# EAGLE design singleAxisMotor3 (EAGLE 5.10)
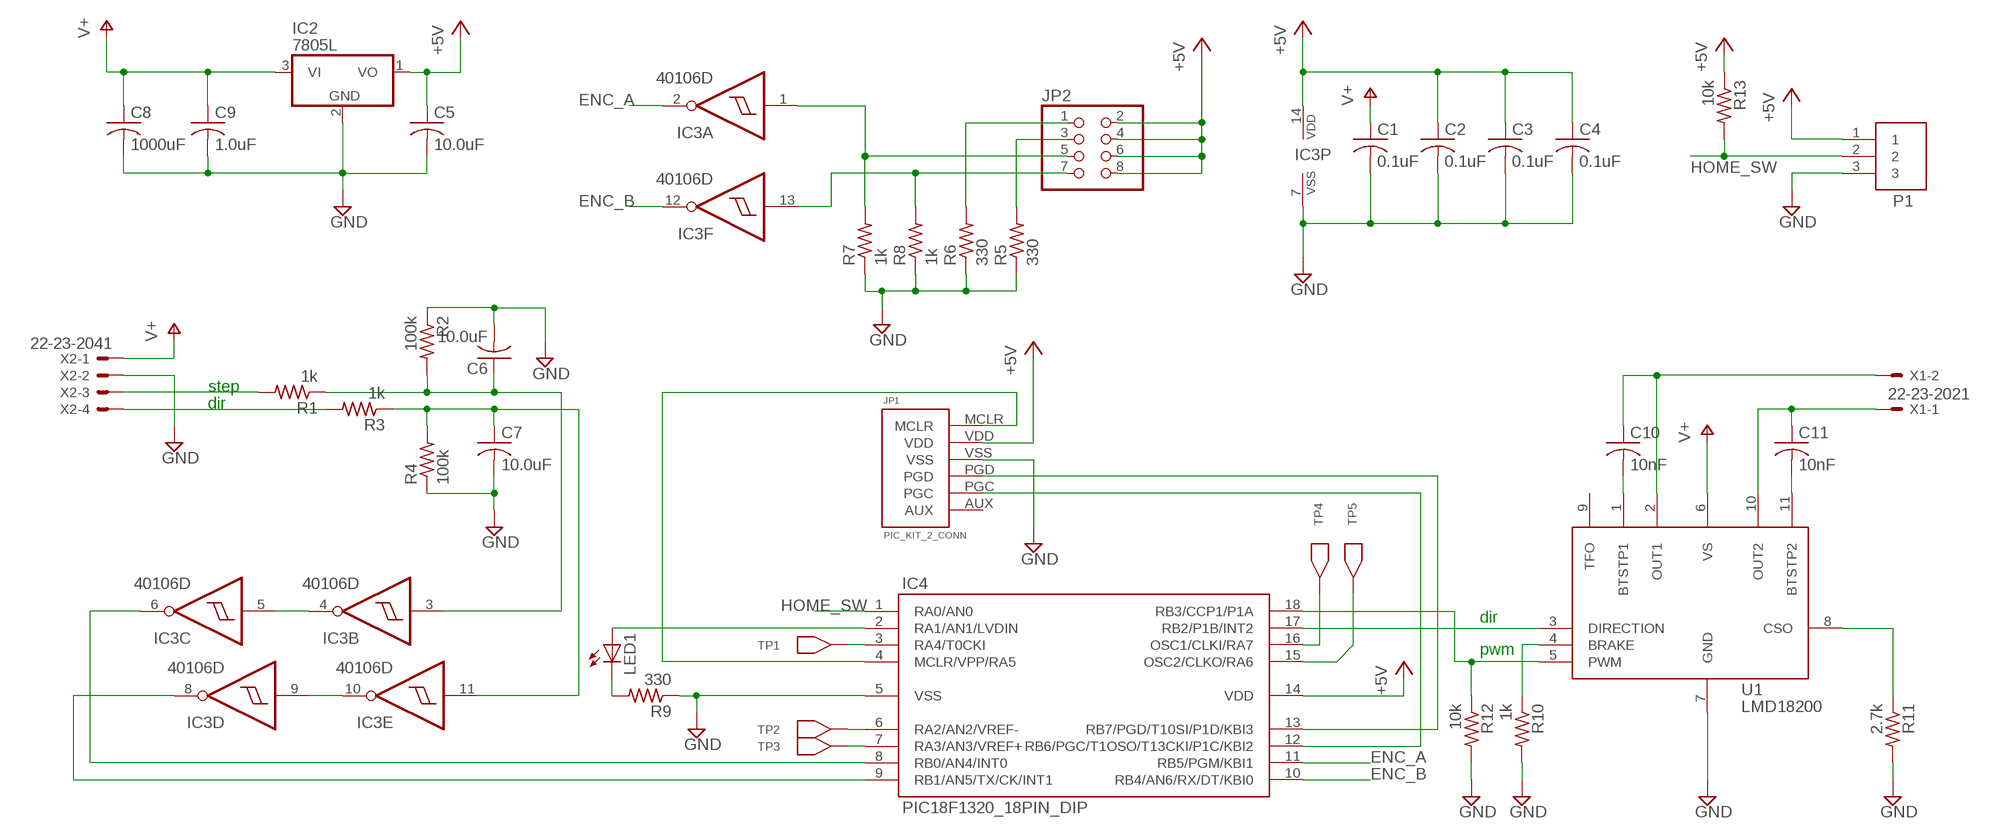
[diagram p0: schematic, sheet 1]

## Parts
C1  0.1uF  C-USC1206  [C1206]
C2  0.1uF  C-USC1206  [C1206]
C3  0.1uF  C-USC1206  [C1206]
C4  0.1uF  C-USC1206  [C1206]
C5  10.0uF  C-US025-024X044  [C025-024X044]
C6  10.0uF  C-USC1206  [C1206]
C7  10.0uF  C-USC1206  [C1206]
C8  1000uF  C-US025-024X044  [C025-024X044]
C9  1.0uF  C-USC1206  [C1206]
C10  10nF  C-USC1206  [C1206]
C11  10nF  C-USC1206  [C1206]
IC2  7805L  [TO92]
IC3  40106D  [SO14]
IC4  PIC18F1320_18PIN_DIP  [SO-18W]
JP1  PIC_KIT_2_CONN  [PIC_KIT_2_CONN]
JP2  PINHD-2X4  [2X04]
LED1  LEDCHIPLED_1206  [CHIPLED_1206]
P1  3PIN  [3PIN]
R1  1k  R-US_0207/2V  [0207/2V]
R2  100k  R-US_0207/2V  [0207/2V]
R3  1k  R-US_0207/2V  [0207/2V]
R4  100k  R-US_0207/2V  [0207/2V]
R5  330  R-US_0207/2V  [0207/2V]
R6  330  R-US_0207/2V  [0207/2V]
R7  1k  R-US_0207/2V  [0207/2V]
R8  1k  R-US_0207/2V  [0207/2V]
R9  330  R-US_0207/2V  [0207/2V]
R10  1k  R-US_M1206  [M1206]
R11  2.7k  R-US_M1206  [M1206]
R12  10k  R-US_M1206  [M1206]
R13  10k  R-US_M1206  [M1206]
TP1  1PAD  [1PAD]
TP2  1PAD  [1PAD]
TP3  1PAD  [1PAD]
TP4  1PAD  [1PAD]
TP5  1PAD  [1PAD]
U1  LMD18200  [TO-220-WIDE]
X1  22-23-2021  [22-23-2021]
X2  22-23-2041  [22-23-2041]

## Nets
+5V: C2.1 C3.1 C4.1 C5.1 IC2.1(VO) IC3.14(P:VDD) IC4.14(VDD) JP1.VDD JP2.2 JP2.4 JP2.6 JP2.8 P1.1 R13.1
DIR: IC3.8(D:O) IC4.9(RB1/AN5/TX/CK/INT1)
ENC_A: IC3.2(A:O) IC4.11(RB5/PGM/KBI1)
ENC_A_PRE_INVERTER: IC3.1(A:I) JP2.5 R7.2
ENC_B: IC3.12(F:O) IC4.10(RB4/AN6/RX/DT/KBI0)
ENC_B_PRE_INVERTER: IC3.13(F:I) JP2.7 R8.2
GND: C1.2 C2.2 C3.2 C4.2 C5.2 C6.2 C7.2 C8.2 C9.2 IC2.2(GND) IC3.7(P:VSS) IC4.5(VSS) JP1.VSS P1.3 R2.1 R4.1 R5.1 R6.1 R7.1 R8.1 R9.1 R10.2 R11.2 R12.2 U1.7(GND) X2.2
HOME_SW: IC4.1(RA0/AN0) P1.2 R13.2
MCLR: IC4.4(MCLR/VPP/RA5) JP1.MCLR
MOT_A: IC4.18(RB3/CCP1/P1A) R12.1 U1.5(PWM)
MOT_B: IC4.17(RB2/P1B/INT2) U1.3(DIRECTION)
N$1: C11.1 U1.10(OUT2) X1.1
N$2: C10.1 U1.2(OUT1) X1.2
N$3: IC3.4(B:O) IC3.5(C:I)
N$4: JP2.1 R6.2
N$5: JP2.3 R5.2
N$6: IC3.9(D:I) IC3.10(E:O)
N$8: IC4.2(RA1/AN1/LVDIN) LED1.A
N$9: LED1.C R9.2
N$11: C10.2 U1.1(BTSTP1)
N$12: C11.2 U1.11(BTSTP2)
N$13: C7.1 IC3.11(E:I) R3.1 R4.2
N$14: C6.1 IC3.3(B:I) R1.1 R2.2
N$15: R10.1 U1.4(BRAKE)
N$16: IC4.16(OSC1/CLKI/RA7) TP4.1
N$17: R1.2 X2.3
N$18: R11.1 U1.8(CSO)
N$19: IC4.3(RA4/T0CKI) TP1.1
N$20: R3.2 X2.4
N$21: IC4.7(RA3/AN3/VREF+) TP3.1
N$22: IC4.6(RA2/AN2/VREF-) TP2.1
N$23: IC4.15(OSC2/CLKO/RA6) TP5.1
PGC: IC4.12(RB6/PGC/T1OSO/T13CKI/P1C/KBI2) JP1.PGC
PGD: IC4.13(RB7/PGD/T10SI/P1D/KBI3) JP1.PGD
STEP: IC3.6(C:O) IC4.8(RB0/AN4/INT0)
V+: C1.1 C8.1 C9.1 IC2.3(VI) U1.6(VS) X2.1
Unconnected: JP1.AUX U1.9(TFO)

## Notes on the sheet
- step
- dir
- dir
- pwm

## Library data of the parts
C1-C11 = rcl:C-US: CAPACITOR, American symbol
IC2 = linear:78*: Positive VOLTAGE REGULATOR Source: http://cache.national.com/ds/LM/LM78L05.pdf http://www.fairchildsemi.com/ds/LM/LM7805.pdf
IC3 = 40xx:40106: Hex SCHMITT TRIGGER
IC4 = modular_robot_parts:PIC18F1320_18PIN_DIP
JP1 = modular_robot_parts:PIC_KIT_2_CONN
JP2 = pinhead:PINHD-2X4: PIN HEADER
LED1 = led:LED: LED OSRAM: - CHIPLED LG R971, LG N971, LY N971, LG Q971, LY Q971, LO R971, LY R971 LH N974, LH R974 LS Q976, LO Q976, LY Q976 LO Q996 - Hyper CHIPLED LW Q18S LB Q993, LB Q99A, LB R99A - SideLED LS A670, LO A670, LY A670, LG A670, LP A670 LB A673, LV A673, LT A673, LW A673 LH A674 LY A675 LS A676, LA A676, LO A676, LY A676, LW A676 LS A679, LY A679, LG A679 - Hyper Micro SIDELED® LS Y876, LA Y876, LO Y876, LY Y876 LT Y87S - SmartLED LW L88C, LW L88S LB L89C, LB L89S, LG L890 LS L89K, LO L89K, LY L89K LS L896, LA L896, LO L896, LY L896 - TOPLED LS T670, LO T670, LY T670, LG T670, LP T670 LSG T670, LSP T670, LSY T670, LOP T670, LYG T670 LG T671, LOG T671, LSG T671 LB T673, LV T673, LT T673, LW T673 LH T674 LS T676, LA T676, LO T676, LY T676, LB T676, LH T676, LSB T676, LW T676 LB T67C, LV T67C, LT T67C, LS T67K, LO T67K, LY T67K, LW E67C LS E67B, LA E67B, LO E67B, LY E67B, LB E67C, LV E67C, LT E67C LW T67C LS T679, LY T679, LG T679 LS T770, LO T770, LY T770, LG T770, LP T770 LB T773, LV T773, LT T773, LW T773 LH T774 LS E675, LA E675, LY E675, LS T675 LS T776, LA T776, LO T776, LY T776, LB T776 LHGB T686 LT T68C, LB T68C - Hyper Mini TOPLED® LB M676 - Mini TOPLED Santana® LG M470 LS M47K, LO M47K, LY M47K Source: http://www.osram.convergy.de LUXEON: - LUMILED® LXK2-PW12-R00, LXK2-PW12-S00, LXK2-PW14-U00, LXK2-PW14-V00 LXK2-PM12-R00, LXK2-PM12-S00, LXK2-PM14-U00 LXK2-PE12-Q00, LXK2-PE12-R00, LXK2-PE12-S00, LXK2-PE14-T00, LXK2-PE14-U00 LXK2-PB12-K00, LXK2-PB12-L00, LXK2-PB12-M00, LXK2-PB14-N00, LXK2-PB14-P00, LXK2-PB14-Q00 LXK2-PR12-L00, LXK2-PR12-M00, LXK2-PR14-Q00, LXK2-PR14-R00 LXK2-PD12-Q00, LXK2-PD12-R00, LXK2-PD12-S00 LXK2-PH12-R00, LXK2-PH12-S00 LXK2-PL12-P00, LXK2-PL12-Q00, LXK2-PL12-R00 Source: www.luxeon.com KINGBRIGHT: KA-3528ASYC Source: www.kingbright.com
P1 = custom:3PIN
R1-R13 = rcl:R-US_: RESISTOR, American symbol
TP1-TP5 = custom:1PAD
U1 = custom:LMD18200
X1 = con-molex:22-23-2021: .100" (2.54mm) Center Header - 2 Pin
X2 = con-molex:22-23-2041: .100" (2.54mm) Center Header - 4 Pin

## Board
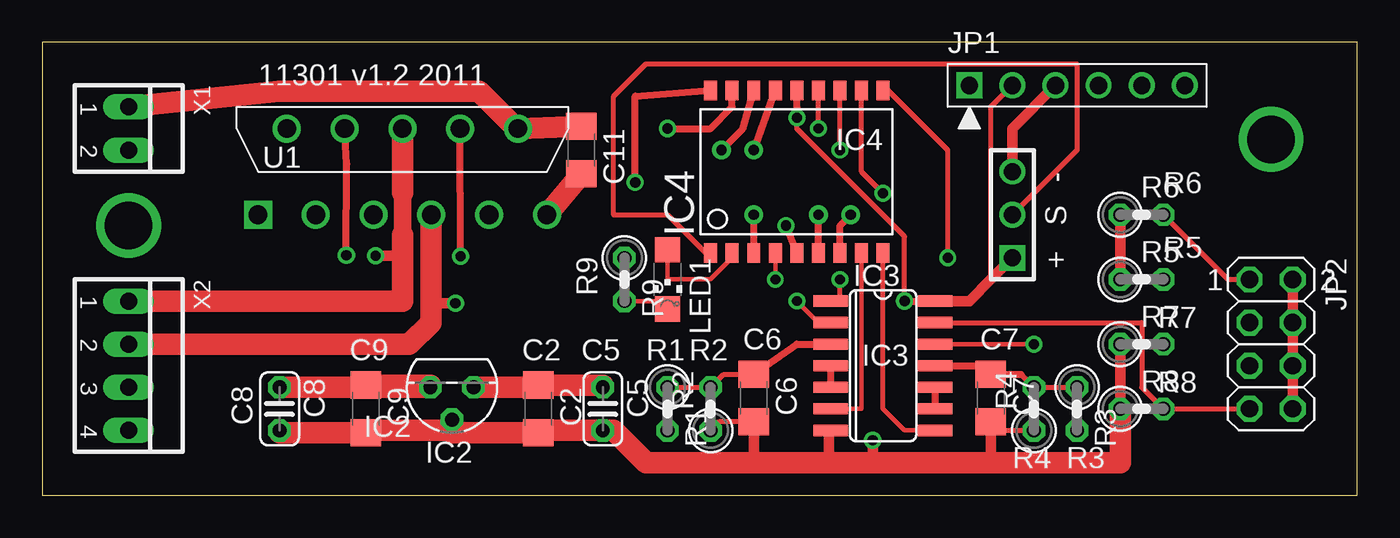
[diagram p1: board, top side]
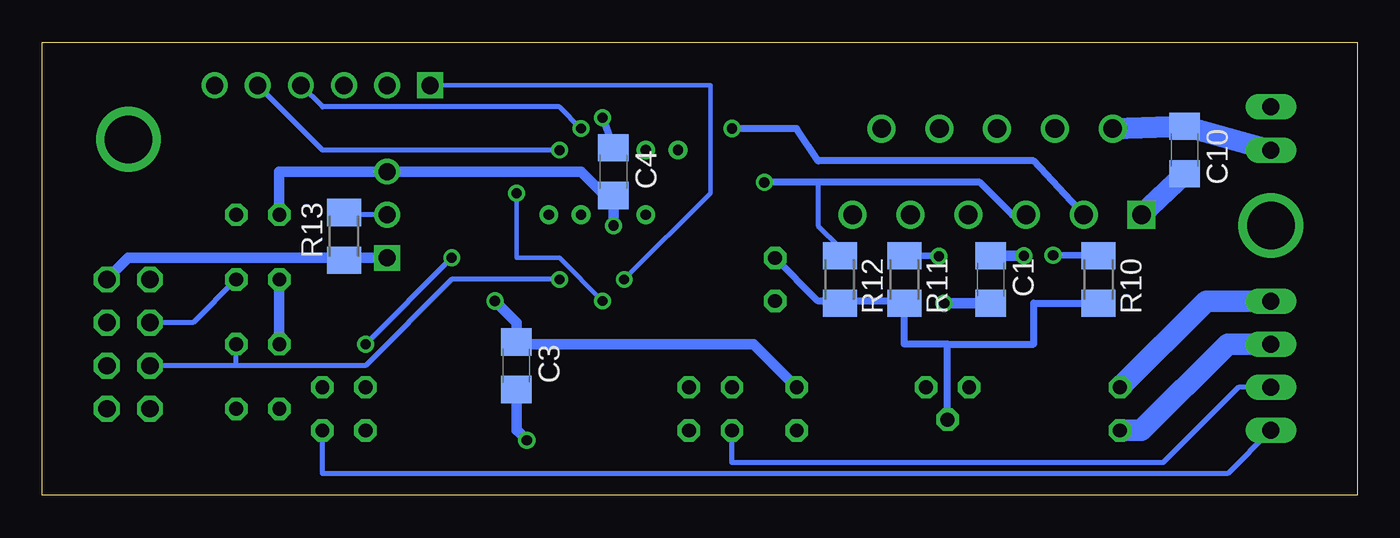
[diagram p2: board, bottom side, seen from below]

Size 77.46 x 26.66 mm. Coordinates in mm from the lower left corner, seen from the top.
Outline: 0,0 77.46,0 77.46,26.66 0,26.66 0,0
Copper layers (1*16): Top 0.035mm / dielectric 1.5mm / Bottom 0.035mm
Design rules "default *": minimum track width 10mil, minimum drill 23mil, track to track 8mil, track to pad 8mil, pad to pad 8mil, via to via 8mil, smd to smd 8mil, copper to edge 40mil, drill to drill 8mil, minimum pad ring 10mil, minimum via ring 8mil, stop-mask expansion 4mil, vias tented up to drill 25mil, thermal gap 10mil

### Footprints (pad centres in the part's own frame; a part is rotated, then mirrored left to right if it is on the bottom)
C1206 = smd 1.6 x 1.8: 1 -1.4,0; 2 1.4,0
C025-024X044 = drill 0.813 octagon: 1 -1.27,0; 2 1.27,0
TO92 = drill 0.813 octagon: 1 -1.27,0; 2 0,1.905; 3 1.27,0
SO14 = smd 0.66 x 2.032: 1 -3.81,-3.073; 2 -2.54,-3.073; 3 -1.27,-3.073; 4 0,-3.073; 5 1.27,-3.073; 6 2.54,-3.073; 7 3.81,-3.073; 8 3.81,3.073; 9 2.54,3.073; 10 1.27,3.073; 11 0,3.073; 12 -1.27,3.073; 13 -2.54,3.073; 14 -3.81,3.073
SO-18W = smd 0.762 x 1.143: 1 -5.08,-4.788; 2 -3.81,-4.788; 3 -2.54,-4.788; 4 -1.27,-4.788; 5 0,-4.788; 6 1.27,-4.788; 7 2.54,-4.788; 8 3.81,-4.788; 9 5.08,-4.788; 10 5.08,4.788; 11 3.81,4.788; 12 2.54,4.788; 13 1.27,4.788; 14 0,4.788; 15 -1.27,4.788; 16 -2.54,4.788; 17 -3.81,4.788; 18 -5.08,4.788
PIC_KIT_2_CONN = drill 1.016 round: AUX 0,6.35; PGC 0,3.81; PGD 0,1.27; VDD 0,-3.81; VSS 0,-1.27 | drill 1.016 square: MCLR 0,-6.35
2X04 = drill 1.016 octagon: 1 -3.81,-1.27; 2 -3.81,1.27; 3 -1.27,-1.27; 4 -1.27,1.27; 5 1.27,-1.27; 6 1.27,1.27; 7 3.81,-1.27; 8 3.81,1.27
CHIPLED_1206 = smd 1.5 x 1.5: A 0,-1.75; C 0,1.75
3PIN = drill 1 square: 1 0,0 | drill 1 round: 2 2.54,0; 3 5.08,0
0207/2V = drill 0.813 octagon: 1 -1.27,0; 2 1.27,0
M1206 = smd 1.6 x 2: 1 -1.4,0; 2 1.4,0
1PAD = drill 0.6 pad 1.016 round: 1 0,0
TO-220-WIDE = drill 1.1 square: 1 0,0 | drill 1.1 round: 2 1.702,5.08; 3 3.404,0; 4 5.105,5.08; 5 6.807,0; 6 8.509,5.08; 7 10.211,0; 8 11.913,5.08; 9 13.614,0; 10 15.316,5.08; 11 17.018,0
22-23-2021 = drill 1 long: 1 -1.27,0; 2 1.27,0
22-23-2041 = drill 1 long: 1 -3.81,0; 2 -1.27,0; 3 1.27,0; 4 3.81,0

### Placement (x,y rotation side)
C1  21.59,12.7 270 bottom
C2  29.21,5.08 270 top
C3  49.53,7.62 270 bottom
C4  43.81,19.05 270 bottom
C5  33.02,5.08 270 top
C6  41.91,5.71 270 top
C7  55.88,5.71 270 top
C8  13.97,5.08 270 top
C9  19.05,5.08 270 top
C10  10.16,20.32 270 bottom
C11  31.75,20.32 270 top
IC2  24.13,6.35 180 top
IC3  49.53,7.62 270 top
IC4  44.45,19.05 0 top
JP1  60.96,24.13 270 top
JP2  72.39,8.89 270 top
LED1  36.83,12.7 180 top
P1  57.15,13.97 90 top
R1  36.83,5.08 270 top
R2  39.37,5.08 90 top
R3  60.96,5.08 270 top
R4  58.42,5.08 90 top
R5  64.77,12.7 0 top
R6  64.77,16.51 0 top
R7  64.77,8.89 0 top
R8  64.77,5.08 0 top
R9  34.29,12.7 270 top
R10  15.24,12.7 270 bottom
R11  26.67,12.7 270 bottom
R12  30.48,12.7 270 bottom
R13  59.69,15.24 90 bottom
TP1  41.91,16.51 180 top
TP2  45.72,16.51 180 top
TP3  47.62,16.51 180 top
TP4  40.01,20.32 180 top
TP5  41.91,20.32 180 top
U1  12.7,16.51 0 top
X1  5.08,21.59 270 top
X2  5.08,7.62 270 top

### Tracks (layer width: path | path; a pad name or v marks a point on that pad's centre or on a via)
+5V  (via drill 0.6)
  Top 0.305: 44.45,22.86 44.45,21.59 50.8,15.24 v50.8,11.43 | JP1.VDD 55.88,22.86 55.88,12.7
  Top 0.406: v50.8,11.43 IC3.14 | v44.45,22.23 44.45,22.86 IC4.14
  Top 0.61: JP2.8 JP2.6 JP2.4 JP2.2 | P1.1 55.88,12.7 54.61,11.43 IC3.14
  Top 1.27: IC2.1 29.21,6.35 C2.1 33.02,6.48 C5.1
  Bottom 0.254: 49.53,8.89 C3.1
  Bottom 0.305: P1.1 57.15,14.1 R13.1
  Bottom 0.406: v44.45,22.23 C4.1
  Bottom 0.61: C3.1 49.53,10.16 v50.8,11.43 | C5.1 35.56,8.89 49.53,8.89 | JP2.2 72.39,13.97 P1.1
DIR
  Top 0.254: 49.53,5.08 50.8,3.81 IC3.8
  Top 0.305: 49.53,5.08 IC4.9
ENC_A  (via drill 0.58)
  Top 0.254: v44.45,11.43 45.72,10.16 IC3.2 | IC4.11 48.26,24.13
  Top 0.305: IC4.11 48.26,19.05 v49.53,17.78
  Bottom 0.254: v49.53,17.78 49.53,13.97 46.99,13.97 v44.45,11.43
ENC_A_PRE_INVERTER  (via drill 0.58)
  Top 0.254: IC3.1 46.99,11.43
  Top 0.305: 46.99,11.43 v46.99,12.7
  Bottom 0.305: v46.99,12.7 53.34,12.7 58.42,7.62 66.04,7.62 | 66.04,7.62 JP2.5 | 66.04,7.62 R7.2
ENC_B  (via drill 0.58)
  Top 0.254: 49.53,24.13 IC4.10 | IC3.12 v58.42,8.89
  Top 0.305: 49.53,24.13 53.34,20.32 v53.34,13.97
  Bottom 0.305: v58.42,8.89 v53.34,13.97
ENC_B_PRE_INVERTER
  Top 0.305: JP2.7 R8.2 64.77,6.35 64.77,10.16 IC3.13
GND  (via drill 0.6)
  Top 0.305: C6.2 39.88,4.32 R2.1 | 55.88,3.81 R4.1
  Top 0.406: v43.81,15.88 IC4.5
  Top 0.61: v24.33,11.3 23.02,11.3 22.89,11.44 | IC3.7 46.33,3.81 46.33,1.91 | 55.88,1.91 55.88,3.81 C7.2 | 41.91,1.91 C6.2 | v48.92,3.23 48.92,2.06 48.77,1.91 | JP1.VSS 57.15,21.59 P1.3 | R5.1 R6.1 | R8.1 R7.1
  Top 1.27: U1.7 22.89,11.44 22.89,10.16 21.61,8.89 X2.2 | C8.2 13.97,3.68 C9.2 19.05,3.81 24.13,3.81 | 24.13,3.81 IC2.2 | 24.13,3.81 24.13,3.68 C2.2 29.21,3.81 C5.2 33.66,3.81 35.56,1.91 41.91,1.91 46.33,1.91 48.77,1.91 55.88,1.91 63.5,1.91 R8.1
  Bottom 0.254: 44.45,17.78 C4.2 | R11.2 26.67,11.43
  Bottom 0.305: 31.75,11.43 30.48,11.43 R12.2
  Bottom 0.406: R11.2 26.67,8.89 24.13,8.89 | IC2.2 24.13,8.89 | R10.2 19.05,11.3 19.05,8.89 24.13,8.89 | R9.1 31.75,11.43 26.67,11.43
  Bottom 0.61: C1.2 v24.33,11.3 | C3.2 49.53,3.81 49.51,3.81 v48.92,3.23 | C4.2 v43.81,15.88 | 44.45,17.78 45.72,19.05 P1.3 63.5,19.05 R6.1 | R7.1 R5.1
  Bottom 1.27: X2.2 7.62,8.89 12.7,3.81 C8.2
HOME_SW
  Top 0.254: 39.37,13.97 IC4.1
  Top 0.305: 39.37,13.97 36.83,16.51 33.66,16.51 33.66,23.5 35.56,25.4 60.96,25.4 60.96,20.32 P1.2
  Bottom 0.305: P1.2 59.56,16.51 R13.2
MCLR  (via drill 0.58)
  Top 0.254: IC4.4 v43.18,12.7
  Bottom 0.254: v43.18,12.7 38.1,17.78 38.1,24.13 JP1.MCLR
MOT_A  (via drill 0.6)
  Top 0.406: IC4.18 34.92,23.5 v34.92,18.41
  Bottom 0.305: R12.1 30.48,14.61 31.75,15.88 31.75,18.41
  Bottom 0.406: U1.5 20.32,16.51 22.23,18.41 31.75,18.41 v34.92,18.41
MOT_B  (via drill 0.6)
  Top 0.406: IC4.17 40.64,22.86 39.37,21.59 v36.83,21.59
  Bottom 0.406: U1.3 19.05,19.68 31.75,19.68 33.02,21.59 v36.83,21.59
N$1
  Top 1.27: C11.1 U1.10 27.94,21.59 25.73,23.8 13.95,23.8 X1.1
N$2
  Bottom 1.27: U1.2 C10.1 X1.2
N$3
  Top 0.406: IC3.5 IC3.4
N$4
  Top 0.305: R6.2 69.85,12.7 JP2.1
N$5
  Bottom 0.305: R5.2 68.58,10.16 JP2.3
N$6
  Top 0.406: IC3.9 IC3.10
N$7  (via drill 2.8)
  other vias: 5.08,15.88
N$8
  Top 0.254: IC4.2 40.64,13.97 39.37,12.7 36.83,12.7 LED1.A
N$9
  Top 0.254: R9.2 36.83,11.43 LED1.C
N$10  (via drill 2.8)
  other vias: 72.39,20.95
N$11
  Bottom 1.27: C10.2 U1.1
N$12
  Top 1.27: U1.11 C11.2
N$13
  Top 0.305: R3.1 R4.2 57.66,7.12
  Top 0.406: IC3.11 55.88,7.62 C7.1 57.66,7.12
N$14
  Top 0.305: C6.1 40.13,7.12 R2.2 R1.1
  Top 0.406: C6.1 44.45,8.89 IC3.3
N$15  (via drill 0.6)
  Top 0.406: U1.4 17.93,19.51 v17.91,14.12
  Bottom 0.406: R10.1 v17.91,14.12
N$16
  Top 0.406: IC4.16 41.27,21.59 TP4.1
N$17
  Bottom 0.305: X2.3 6.99,6.35 11.43,1.91 36.83,1.91 R1.2
N$18  (via drill 0.6)
  Top 0.406: v24.64,14.07 U1.8
  Bottom 0.406: v24.64,14.07 R11.1
N$19
  Top 0.406: IC4.3 TP1.1
N$20
  Bottom 0.305: X2.4 7.62,1.27 60.96,1.27 R3.2
N$21
  Top 0.406: IC4.7 46.99,15.88 TP3.1
N$22
  Top 0.406: IC4.6 TP2.1
N$23
  Top 0.406: TP5.1 IC4.15
PGC  (via drill 0.58)
  Top 0.254: IC4.12 46.99,24.13
  Top 0.305: v46.99,20.32 IC4.12
  Bottom 0.305: v46.99,20.32 60.96,20.32 JP1.PGC
PGD  (via drill 0.58)
  Top 0.254: IC4.13 45.72,24.13
  Top 0.305: v45.72,21.59 IC4.13
  Bottom 0.305: v45.72,21.59 46.99,22.86 60.96,22.86 JP1.PGD
STEP
  Top 0.254: IC4.8 48.26,5.08 IC3.6
V+  (via drill 0.6)
  Top 0.61: v19.63,14.1 21.08,14.1 21.21,13.97
  Top 1.016: 21.21,15.34 21.21,17.8
  Top 1.27: 21.21,17.8 U1.6 | 21.21,15.34 21.21,13.97 21.21,11.43 X2.1 | C8.1 IC2.3 22.86,6.48 C9.1
  Bottom 0.61: C1.1 v19.64,14.1 v19.63,14.1
  Bottom 1.27: C8.1 8.89,11.43 X2.1

### Text on the board
tPlace: 11301 v1.2 2011 | 1 | IC4 | 2 | U1 | - | R6 | S | R5 | + | 1 | R9 | 1 | 2 | R7 | 2 | C6 | C7 | C9 | C2 | C5 | R1 | R2 | IC3 | 3 | R8 | 4 | C8 | IC2 | R4 | R3